# Altium project Compressor.PrjPcb (part 2 of 4)
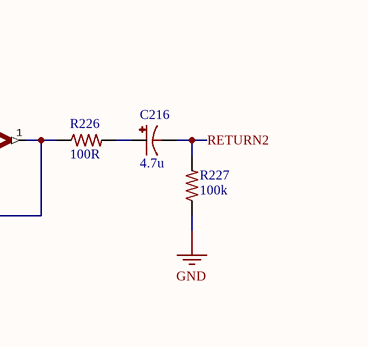
[diagram p4: Compressor.SchDoc, bottom right]

## Sheet Compressor.SchDoc (continued)
### Library data of the parts
ATTACK = POT_500kB_ALPHA_9mm: 500k Lin potentiometer round shaft; Price: 1.3; Dimensions: 9mm; Package: PCB Mounted
BLEND = POT_10kB_ALPHA_9mm: 10k Lin potentiometer round shaft; Price: 1.3; Dimensions: 9mm; Package: PCB Mounted
C1 C4 C101 C201 = MCVVT025M101EA6L: CAP ALUM 100UF 25V SMD; Manufacturer: Multicomp; Life (Hours): 2000Hour; Ripple Current (AC): 6.3mA; Supplier 1: Farnell; Supplier Part Number 1: 2611370; Manufacturer Part Number: MCVVT025M101EA6L; Stock: 1063; Pricing: 1=0.157, 50=0.104, 100=0.0932, 250=0.0801, 500=0.0681 (EUR); RoHS: No; Min Operating Temperature: -55°C; Max Operating Temperature: 105°C; Capacitance: 100uF; Voltage Rating: 25V; Packaging: Tape and Reel; Voltage Rating (DC): 25V; Diameter: 6.3mm; Height: 7.7mm; REACH SVHC: No SVHC; ComponentLink1URL: http://www.farnell.com/datasheets/2151198.pdf?src-supplier=Element14; ComponentLink1Description: http://www.farnell.com/datasheets/2151198.pdf?src-supplier=Element14; Price: 0.102
C2 C3 C5 C104 C105 C203 C204 = MC0603B104K500CT: CAP CER 100NF 50V X7R 0603; Manufacturer: Multicomp; Tolerance: 10%; Supplier 1: Farnell; Supplier Part Number 1: 1759122; Manufacturer Part Number: MC0603B104K500CT; Stock 1: 1057763; RoHS: Yes; Case/Package: 0603; Number of Pins: 2; Case Code (Metric): 1608; Case Code (Imperial): 0603; Min Operating Temperature: -55°C; Max Operating Temperature: 125°C; Packaging: Cut Tape; Voltage Rating: 50V; Capacitance: 100nF; Dielectric: X7R; Voltage Rating (DC): 50V; REACH SVHC: Unknown; ComponentLink1URL: https://datasheet.ciiva.com/22686/1901289-22686278.pdf?src-supplier=Element14; ComponentLink1Description: https://datasheet.ciiva.com/22686/1901289-22686278.pdf?src-supplier=Element14; ComponentLink2URL: https://datasheet.ciiva.com/22686/1901289-22686279.pdf?src-supplier=Element14; ComponentLink2Description: https://datasheet.ciiva.com/22686/1901289-22686279.pdf?src-supplier=Element14; ComponentLink3URL: https://datasheet.ciiva.com/22648/1901289-22648411.pdf?src-supplier=Element14; ComponentLink3Description: https://datasheet.ciiva.com/22648/1901289-22648411.pdf?src-supplier=Element14; Price: 0.0458
C102 C103 = MCVVT025M100CA1L: CAP ALUM 10UF 25V SMD; Manufacturer: Multicomp; Life (Hours): 2000Hour; Ripple Current (AC): 4mA; Supplier 1: Farnell; Supplier Part Number 1: 2611368; Manufacturer Part Number: MCVVT025M100CA1L; Stock: 2773; Pricing: 5=0.0897, 50=0.0592, 250=0.0457, 500=0.0388, 1000=0.0338 (EUR); RoHS: No; Min Operating Temperature: -55°C; Max Operating Temperature: 105°C; Capacitance: 10uF; Voltage Rating: 25V; Packaging: Cut Tape; Voltage Rating (DC): 25V; Diameter: 4mm; Height: 5.4mm; REACH SVHC: No SVHC; ComponentLink1URL: http://www.farnell.com/datasheets/2151198.pdf?src-supplier=Element14; ComponentLink1Description: http://www.farnell.com/datasheets/2151198.pdf?src-supplier=Element14; Price: 0.0592
C106 C108 C111 C113 = GRM1885C1H103JA01D: CAP CER 10NF 50V C0G/NP0 0603; Manufacturer: Murata; Material: Ceramic; Tolerance: 5%; Dielectric: C0G; Supplier 1: Farnell; Supplier Part Number 1: 2456107; Manufacturer Part Number: GRM1885C1H103JA01D; Stock 1: 99456; Pricing 1: 10 = 0.16600, 100 = 0.07230, 500 = 0.04810, 1000 = 0.04130, 2000 = 0.03640 (EUR); RoHS: Yes; Mount: Surface Mount; Case/Package: 0603; Case Code (Metric): 1608; Case Code (Imperial): 0603; Min Operating Temperature: -55°C; Max Operating Temperature: 125°C; Packaging: Tape and Reel; Package Quantity: 4000; Capacitance: 10nF; Voltage Rating: 50V; Voltage Rating (DC): 50V; Termination: SMD/SMT; Voltage: 50V; Length: 1.6mm; Height: 0.8mm; Width: 0.8mm; Thickness: 0.035inch; Lead Pitch: 0.5mm; Depth: 0.8mm; REACH SVHC: No SVHC; Lead Free: Lead Free; ComponentLink1URL: https://datasheet.ciiva.com/29537/partnumbering-e-01-29537910.pdf?src-supplier=Digi-Key; ComponentLink1Description: https://datasheet.ciiva.com/29537/partnumbering-e-01-29537910.pdf?src-supplier=Digi-Key; ComponentLink2URL: https://datasheet.ciiva.com/41860/partnumbering-e-01-41860759.pdf?src-supplier=Digi-Key; ComponentLink2Description: https://datasheet.ciiva.com/41860/partnumbering-e-01-41860759.pdf?src-supplier=Digi-Key; Price: 0.0723
C107 C115 C206 C208 C210 C211 C213 C214 = EEEFC1H1R0R: CAP ALUM 1UF 50V LESR SMD; Manufacturer: Panasonic; Dielectric Material: Aluminium; Tolerance: 20%; Ripple Current: 30mA; ESR (Equivalent Series Resistance): 5R; Life (Hours): 1000Hour; Leakage Current: 3uA; Lead Length: 1.8mm; Supplier 1: Farnell; Supplier Part Number 1: 9694528; Manufacturer Part Number: EEEFC1H1R0R; Stock 1: 3801; Pricing 1: 5 = 0.29200, 50 = 0.15100, 250 = 0.12600, 500 = 0.09460, 1000 = 0.07990 (EUR); RoHS: Yes; Mount: Surface Mount; Case/Package: Radial; Number of Pins: 2; Material: Aluminium; Contact Plating: Tin; Min Operating Temperature: -40°C; Max Operating Temperature: 105°C; Capacitance: 1uF; Voltage Rating: 50V; Packaging: Tape and Reel; Voltage Rating (DC): 50V; Package Quantity: 2000; Termination: SMD/SMT; Ripple Current (AC): 30mA; Impedance: 5R; Voltage: 50V; Diameter: 4mm; Length: 5.5mm; Height: 5.4mm; Height - Seated (Max): 0.213inch; Width: 4.3mm; Lead Pitch: 1mm; Radiation Hardening: No; REACH SVHC: No SVHC; Lead Free: Lead Free; ComponentLink1URL: https://datasheet.ciiva.com/11779/0900766b806bc525-11779769.pdf?src-supplier=RSComponents; ComponentLink1Description: https://datasheet.ciiva.com/11779/0900766b806bc525-11779769.pdf?src-supplier=RSComponents; ComponentLink2URL: https://datasheet.ciiva.com/29313/443524-da-01-en-smd-elko-vfc-b-1-0-uf-50v-29313787.pdf?src-supplier=Conrad; ComponentLink2Description: https://datasheet.ciiva.com/29313/443524-da-01-en-smd-elko-vfc-b-1-0-uf-50v-29313787.pdf?src-supplier=Conrad; ComponentLink3URL: https://datasheet.ciiva.com/10331/aba0000ce5-10331045.pdf?src-supplier=Avnet; ComponentLink3Description: https://datasheet.ciiva.com/10331/aba0000ce5-10331045.pdf?src-supplier=Avnet; ComponentLink4URL: https://datasheet.ciiva.com/43485/31718-43485413.pdf?src-supplier=Farnell; ComponentLink4Description: https://datasheet.ciiva.com/43485/31718-43485413.pdf?src-supplier=Farnell; ComponentLink5URL: https://datasheet.ciiva.com/17353/aba0000ce5-17353382.pdf?src-supplier=Avnet+Europe; ComponentLink5Description: https://datasheet.ciiva.com/17353/aba0000ce5-17353382.pdf?src-supplier=Avnet+Europe; ComponentLink6URL: https://datasheet.ciiva.com/24024/aba0000ce5-68492-24024840.pdf?src-supplier=Mouser; ComponentLink6Description: https://datasheet.ciiva.com/24024/aba0000ce5-68492-24024840.pdf?src-supplier=Mouser; ComponentLink7URL: https://datasheet.ciiva.com/48542/eeefc-series-eng-tds-48542747.pdf?src-supplier=Distrelec; ComponentLink7Description: https://datasheet.ciiva.com/48542/eeefc-series-eng-tds-48542747.pdf?src-supplier=Distrelec; ComponentLink8URL: https://datasheet.ciiva.com/30181/aba0000ce5-30181516.pdf?src-supplier=Onlinecomponents.com; ComponentLink8Description: https://datasheet.ciiva.com/30181/aba0000ce5-30181516.pdf?src-supplier=Onlinecomponents.com; ComponentLink9URL: https://datasheet.ciiva.com/14596/70068018-14596941.pdf?src-supplier=Allied+Electronics; ComponentLink9Description: https://datasheet.ciiva.com/14596/70068018-14596941.pdf?src-supplier=Allied+Electronics; ComponentLink10URL: https://datasheet.ciiva.com/46388/31718-46388238.pdf?src-supplier=Element14; ComponentLink10Description: https://datasheet.ciiva.com/46388/31718-46388238.pdf?src-supplier=Element14; ComponentLink11URL: https://datasheet.ciiva.com/14606/70256381-14606527.pdf?src-supplier=Allied+Electronics; ComponentLink11Description: https://datasheet.ciiva.com/14606/70256381-14606527.pdf?src-supplier=Allied+Electronics; Price: 0.151
C109 = T491A105K016AT: CAP TANT 1UF 16V; Manufacturer: KEMET; Dielectric Material: Tantalum; Tolerance: 20%; ESR (Equivalent Series Resistance): 10R; Life (Hours): 2000Hour; Polarity: Polar; Dissipation Factor: 4%; Leakage Current: 500nA; Ripple Current: 87mA; Supplier 1: Farnell; Supplier Part Number 1: 1457406; Manufacturer Part Number: T491A105K016AT; RoHS: Yes; Category: Tantalum Capacitors; Stock: 40067; Pricing: 5=0.25600, 50=0.14500, 250=0.11900, 500=0.10600, 1000=0.09590 (EUR); Mount: Surface Mount,PCB; Case/Package: 1206; Number of Pins: 2; Case Code (Imperial): 1206; Case Code (Metric): 3216; Min Operating Temperature: -55°C; Max Operating Temperature: 125°C; Capacitance: 1uF; Packaging: Tape and Reel; Voltage Rating: 16V; Features: General Purpose; Package Quantity: 1; Voltage Rating (DC): 16V; Termination: SMD/SMT; Voltage: 16V; Length: 3.2mm; Height: 1.6mm; Depth: 1.6mm; Width: 1.6mm; Height - Seated (Max): 0.071inch; REACH SVHC: No SVHC; Lead Free: Lead Free; ComponentLink1URL: https://datasheet.ciiva.com/7696/1732736-7696289.pdf?src-supplier=Element14; ComponentLink1Description: https://datasheet.ciiva.com/7696/1732736-7696289.pdf?src-supplier=Element14; ComponentLink2URL: https://datasheet.ciiva.com/20171/458280-da-en-01-20171909.pdf?src-supplier=Rapid+Electronics; ComponentLink2Description: https://datasheet.ciiva.com/20171/458280-da-en-01-20171909.pdf?src-supplier=Rapid+Electronics; ComponentLink3URL: https://datasheet.ciiva.com/34302/1573169-34302502.pdf?src-supplier=Jameco; ComponentLink3Description: https://datasheet.ciiva.com/34302/1573169-34302502.pdf?src-supplier=Jameco; ComponentLink4URL: https://datasheet.ciiva.com/11793/0900766b80718482-11793119.pdf?src-supplier=RSComponents; ComponentLink4Description: https://datasheet.ciiva.com/11793/0900766b80718482-11793119.pdf?src-supplier=RSComponents; ComponentLink5URL: https://datasheet.ciiva.com/5934/kem-t2005-t491-5934792.pdf?src-supplier=Farnell; ComponentLink5Description: https://datasheet.ciiva.com/5934/kem-t2005-t491-5934792.pdf?src-supplier=Farnell; ComponentLink6URL: https://datasheet.ciiva.com/12882/kem-t2005-t491-12882490.pdf?src-supplier=Mouser; ComponentLink6Description: https://datasheet.ciiva.com/12882/kem-t2005-t491-12882490.pdf?src-supplier=Mouser; ComponentLink7URL: https://datasheet.ciiva.com/32431/t491a105k016zt-eng-tds-32431595.pdf?src-supplier=Distrelec; ComponentLink7Description: https://datasheet.ciiva.com/32431/t491a105k016zt-eng-tds-32431595.pdf?src-supplier=Distrelec; ComponentLink8URL: https://datasheet.ciiva.com/257/kem-t2005-t491-257404.pdf?src-supplier=Digi-Key; ComponentLink8Description: https://datasheet.ciiva.com/257/kem-t2005-t491-257404.pdf?src-supplier=Digi-Key; ComponentLink9URL: https://datasheet.ciiva.com/257/kem-t2005-t491-257405.pdf?src-supplier=Digi-Key; ComponentLink9Description: https://datasheet.ciiva.com/257/kem-t2005-t491-257405.pdf?src-supplier=Digi-Key; ComponentLink10URL: https://datasheet.ciiva.com/7696/kem-t2005-t491-7696429.pdf?src-supplier=Element14; ComponentLink10Description: https://datasheet.ciiva.com/7696/kem-t2005-t491-7696429.pdf?src-supplier=Element14; ComponentLink11URL: https://datasheet.ciiva.com/257/kem-t2005-t491-257406.pdf?src-supplier=Digi-Key; ComponentLink11Description: https://datasheet.ciiva.com/257/kem-t2005-t491-257406.pdf?src-supplier=Digi-Key; ComponentLink12URL: https://datasheet.ciiva.com/14595/70095774-14595055.pdf?src-supplier=Allied+Electronics; ComponentLink12Description: https://datasheet.ciiva.com/14595/70095774-14595055.pdf?src-supplier=Allied+Electronics
C110 = GRM1885C1H102JA01D: CAP CER 1NF 50V C0G/NP0 0603; Manufacturer: Murata; Material: Ceramic; Tolerance: 5%; Dielectric: C0G; Temperature Coefficient: 30ppm/°C; Insulation Resistance: 10GR; Supplier 1: Farnell; Supplier Part Number 1: 8819920; Manufacturer Part Number: GRM1885C1H102JA01D; Stock 1: 138332; Pricing 1: 10 = 0.08650, 100 = 0.03970, 500 = 0.02290, 1000 = 0.01860, 2000 = 0.01690 (EUR); RoHS: Yes; Mount: Surface Mount; Case/Package: 0603; Number of Pins: 2; Case Code (Imperial): 0603; Case Code (Metric): 1608; Dielectric Material: Ceramic; Min Operating Temperature: -55°C; Max Operating Temperature: 125°C; Capacitance: 1nF; Voltage Rating: 50V; Packaging: Tape and Reel; Voltage Rating (DC): 50V; Package Quantity: 1; Termination: SMD/SMT; Voltage: 50V; Length: 1.6mm; Height: 0.8mm; Width: 0.8mm; Thickness: 0.035inch; Depth: 0.8mm; Radiation Hardening: No; REACH SVHC: No SVHC; Lead Free: Lead Free; ComponentLink1URL: https://datasheet.ciiva.com/18184/getdatasheetpartid-153109-18184812.pdf?src-supplier=Verical; ComponentLink1Description: https://datasheet.ciiva.com/18184/getdatasheetpartid-153109-18184812.pdf?src-supplier=Verical; ComponentLink2URL: https://datasheet.ciiva.com/29149/450301-da-01-en-vs-kondensator-0603-29149020.pdf?src-supplier=Conrad; ComponentLink2Description: https://datasheet.ciiva.com/29149/450301-da-01-en-vs-kondensator-0603-29149020.pdf?src-supplier=Conrad; ComponentLink3URL: https://datasheet.ciiva.com/5421/product-5421450.pdf?src-supplier=Mouser; ComponentLink3Description: https://datasheet.ciiva.com/5421/product-5421450.pdf?src-supplier=Mouser; ComponentLink4URL: https://datasheet.ciiva.com/131/partnumbering-e-01-131963.pdf?src-supplier=Digi-Key; ComponentLink4Description: https://datasheet.ciiva.com/131/partnumbering-e-01-131963.pdf?src-supplier=Digi-Key; ComponentLink5URL: https://datasheet.ciiva.com/131/partnumbering-e-01-131964.pdf?src-supplier=Digi-Key; ComponentLink5Description: https://datasheet.ciiva.com/131/partnumbering-e-01-131964.pdf?src-supplier=Digi-Key; ComponentLink6URL: https://datasheet.ciiva.com/6072/4360-6072460.pdf?src-supplier=Farnell; ComponentLink6Description: https://datasheet.ciiva.com/6072/4360-6072460.pdf?src-supplier=Farnell; ComponentLink7URL: https://datasheet.ciiva.com/131/partnumbering-e-01-131965.pdf?src-supplier=Digi-Key; ComponentLink7Description: https://datasheet.ciiva.com/131/partnumbering-e-01-131965.pdf?src-supplier=Digi-Key; ComponentLink8URL: https://datasheet.ciiva.com/7828/1784402-7828893.pdf?src-supplier=Element14; ComponentLink8Description: https://datasheet.ciiva.com/7828/1784402-7828893.pdf?src-supplier=Element14; ComponentLink9URL: https://datasheet.ciiva.com/7828/1784402-7828894.pdf?src-supplier=Element14; ComponentLink9Description: https://datasheet.ciiva.com/7828/1784402-7828894.pdf?src-supplier=Element14; ComponentLink10URL: https://datasheet.ciiva.com/7828/4360-7828895.pdf?src-supplier=Element14; ComponentLink10Description: https://datasheet.ciiva.com/7828/4360-7828895.pdf?src-supplier=Element14; Price: 0.0397
C112 C209 C212 = T491A106K016AT: CAP TANT 10UF 16V; Manufacturer: KEMET; Dielectric Material: Tantalum; Tolerance: 10%; ESR (Equivalent Series Resistance): 7R; Life (Hours): 2000Hour; Polarity: Polar; Leakage Current: 1.6uA; Ripple Current: 104mA; Supplier 1: Farnell; Supplier Part Number 1: 1457414; Manufacturer Part Number: T491A106K016AT; RoHS: Yes; Category: Tantalum Capacitors; Stock: 36020; Pricing: 5=0.30300, 50=0.16000, 250=0.13300, 500=0.12000, 1000=0.10200 (EUR); Mount: Surface Mount,PCB; Case/Package: 1206; Number of Pins: 2; Case Code (Metric): 3216; Case Code (Imperial): 1206; Min Operating Temperature: -55°C; Max Operating Temperature: 125°C; Capacitance: 10uF; Packaging: Tape and Reel; Voltage Rating: 16V; Features: General Purpose; Dissipation Factor: 10%; Package Quantity: 1; Voltage Rating (DC): 16V; Termination: SMD/SMT; Failure Rate: 0.001%; Voltage: 16V; Length: 3.2mm; Height: 1.6mm; Width: 1.6mm; Depth: 1.6mm; Height - Seated (Max): 0.071inch; Lead Pitch: 1.2mm; Radiation Hardening: No; Lead Free: Lead Free; REACH SVHC: No SVHC; ComponentLink1URL: https://datasheet.ciiva.com/7696/1732745-7696294.pdf?src-supplier=Element14; ComponentLink1Description: https://datasheet.ciiva.com/7696/1732745-7696294.pdf?src-supplier=Element14; ComponentLink2URL: https://datasheet.ciiva.com/34302/1573257-34302505.pdf?src-supplier=Jameco; ComponentLink2Description: https://datasheet.ciiva.com/34302/1573257-34302505.pdf?src-supplier=Jameco; ComponentLink3URL: https://datasheet.ciiva.com/7696/1854511-7696293.pdf?src-supplier=Element14; ComponentLink3Description: https://datasheet.ciiva.com/7696/1854511-7696293.pdf?src-supplier=Element14; ComponentLink4URL: https://datasheet.ciiva.com/14586/70095774-14586694.pdf?src-supplier=Allied+Electronics; ComponentLink4Description: https://datasheet.ciiva.com/14586/70095774-14586694.pdf?src-supplier=Allied+Electronics; ComponentLink5URL: https://datasheet.ciiva.com/6248/kem-t2005-t491-6248087.pdf?src-supplier=Digi-Key; ComponentLink5Description: https://datasheet.ciiva.com/6248/kem-t2005-t491-6248087.pdf?src-supplier=Digi-Key; ComponentLink6URL: https://datasheet.ciiva.com/6248/kem-t2005-t491-6248088.pdf?src-supplier=Digi-Key; ComponentLink6Description: https://datasheet.ciiva.com/6248/kem-t2005-t491-6248088.pdf?src-supplier=Digi-Key; ComponentLink7URL: https://datasheet.ciiva.com/14113/t491serie-eng-tds-14113132.pdf?src-supplier=Distrelec; ComponentLink7Description: https://datasheet.ciiva.com/14113/t491serie-eng-tds-14113132.pdf?src-supplier=Distrelec; ComponentLink8URL: https://datasheet.ciiva.com/7696/1923792-7696431.pdf?src-supplier=Element14; ComponentLink8Description: https://datasheet.ciiva.com/7696/1923792-7696431.pdf?src-supplier=Element14; ComponentLink9URL: https://datasheet.ciiva.com/7696/1854511-7696295.pdf?src-supplier=Element14; ComponentLink9Description: https://datasheet.ciiva.com/7696/1854511-7696295.pdf?src-supplier=Element14; ComponentLink10URL: https://datasheet.ciiva.com/14605/70095774-14605543.pdf?src-supplier=Allied+Electronics; ComponentLink10Description: https://datasheet.ciiva.com/14605/70095774-14605543.pdf?src-supplier=Allied+Electronics; ComponentLink11URL: https://datasheet.ciiva.com/7696/1446014-7696296.pdf?src-supplier=Element14; ComponentLink11Description: https://datasheet.ciiva.com/7696/1446014-7696296.pdf?src-supplier=Element14; ComponentLink12URL: https://datasheet.ciiva.com/6248/kem-t2005-t491-6248089.pdf?src-supplier=Digi-Key; ComponentLink12Description: https://datasheet.ciiva.com/6248/kem-t2005-t491-6248089.pdf?src-supplier=Digi-Key; ComponentLink13URL: https://datasheet.ciiva.com/12882/kem-t2005-t491-12882730.pdf?src-supplier=Mouser; ComponentLink13Description: https://datasheet.ciiva.com/12882/kem-t2005-t491-12882730.pdf?src-supplier=Mouser; ComponentLink14URL: https://datasheet.ciiva.com/39123/kem-t2005-t491-39123278.pdf?src-supplier=Onlinecomponents.com; ComponentLink14Description: https://datasheet.ciiva.com/39123/kem-t2005-t491-39123278.pdf?src-supplier=Onlinecomponents.com; ComponentLink15URL: https://datasheet.ciiva.com/29244/458306-da-01-de-kondensator-10uf-3216-10pr-16v-85c-29244588.pdf?src-supplier=Conrad; ComponentLink15Description: https://datasheet.ciiva.com/29244/458306-da-01-de-kondensator-10uf-3216-10pr-16v-85c-29244588.pdf?src-supplier=Conrad
C114 = GCM31M5C1H473JA16L: CAP CER 47NF 50V C0G/NP0 1206; Manufacturer: Murata; Tolerance: 5%; Dielectric: C0G; Supplier 1: Farnell; Supplier Part Number 1: 2218706; Manufacturer Part Number: GCM31M5C1H473JA16L; Stock 1: 4840; Pricing 1: 5 = 0.24800, 50 = 0.13700, 250 = 0.11600, 500 = 0.08300, 1500 = 0.07700, 3000 = 0.07360 (EUR); RoHS: Yes; Mount: Surface Mount; Case/Package: 1206; Case Code (Metric): 3216; Case Code (Imperial): 1206; Min Operating Temperature: -55°C; Max Operating Temperature: 125°C; Package Quantity: 1; Capacitance: 47nF; Voltage Rating: 50V; Packaging: Tape and Reel; Voltage Rating (DC): 50V; Termination: SMD/SMT; Length: 3.2mm; Height: 1.15mm; Width: 0.063inch; Thickness: 0.049inch; Depth: 1.6mm; Ratings: AEC-Q200; Radiation Hardening: No; REACH SVHC: No SVHC; ComponentLink1URL: https://datasheet.ciiva.com/136/s0720e-136368.pdf?src-supplier=Digi-Key; ComponentLink1Description: https://datasheet.ciiva.com/136/s0720e-136368.pdf?src-supplier=Digi-Key; ComponentLink2URL: https://datasheet.ciiva.com/11607/product-11607763.pdf?src-supplier=Avnet; ComponentLink2Description: https://datasheet.ciiva.com/11607/product-11607763.pdf?src-supplier=Avnet; ComponentLink3URL: https://datasheet.ciiva.com/18183/getdatasheetpartid-569724-18183753.pdf?src-supplier=Verical; ComponentLink3Description: https://datasheet.ciiva.com/18183/getdatasheetpartid-569724-18183753.pdf?src-supplier=Verical; ComponentLink4URL: https://datasheet.ciiva.com/140/s0717e-140734.pdf?src-supplier=Digi-Key; ComponentLink4Description: https://datasheet.ciiva.com/140/s0717e-140734.pdf?src-supplier=Digi-Key; ComponentLink5URL: https://datasheet.ciiva.com/140/s0717e-140735.pdf?src-supplier=Digi-Key; ComponentLink5Description: https://datasheet.ciiva.com/140/s0717e-140735.pdf?src-supplier=Digi-Key; Price: 0.333
C116 = MC0603N390J500CT: CAP CER 39PF 50V C0G/NP0 0603; Manufacturer: Multicomp; Temperature Coefficient: 30ppm/°C; Dielectric: C0G; Tolerance: 5%; Supplier 1: Farnell; Supplier Part Number 1: 1759060; Manufacturer Part Number: MC0603N390J500CT; RoHS: Yes; Category: Ceramic Capacitors; Stock: 6461; Pricing: 10=0.03890, 100=0.02920, 500=0.01670, 1000=0.01170, 2000=0.01080 (EUR); Case/Package: 0603; Number of Pins: 2; Case Code (Imperial): 0603; Case Code (Metric): 1608; Min Operating Temperature: -55°C; Max Operating Temperature: 125°C; Capacitance: 39pF; Packaging: Cut Tape; Voltage Rating: 50V; Voltage Rating (DC): 50V; Width: 0.8mm; REACH SVHC: Unknown; ComponentLink1URL: https://datasheet.ciiva.com/22648/1901289-22648501.pdf?src-supplier=Element14; ComponentLink1Description: https://datasheet.ciiva.com/22648/1901289-22648501.pdf?src-supplier=Element14; ComponentLink2URL: https://datasheet.ciiva.com/22675/1901289-22675703.pdf?src-supplier=Element14; ComponentLink2Description: https://datasheet.ciiva.com/22675/1901289-22675703.pdf?src-supplier=Element14
C117 C216 = EEEFC1H4R7R: CAP ALUM 4.7UF 50V LESR SMD; Manufacturer: Panasonic; Dielectric Material: Aluminium; Tolerance: 20%; Ripple Current: 50mA; Impedance: 3R; Life (Hours): 1000Hour; Leakage Current: 3uA; Lead Length: 2.2mm; Supplier 1: Farnell; Supplier Part Number 1: 9694552; Manufacturer Part Number: EEEFC1H4R7R; Stock 1: 1971; Pricing 1: 1 = 0.26900, 50 = 0.18200, 100 = 0.14200, 250 = 0.13200, 500 = 0.09890 (EUR); RoHS: Yes; Mount: Surface Mount; Case/Package: Radial; Number of Pins: 2; Contact Plating: Tin; Min Operating Temperature: -40°C; Max Operating Temperature: 105°C; Capacitance: 4.7uF; Voltage Rating: 50V; Packaging: Tape and Reel; Package Quantity: 1; Ripple Current (AC): 50mA; Voltage Rating (DC): 50V; ESR (Equivalent Series Resistance): 3R; Termination: SMD/SMT; Voltage: 50V; Diameter: 5mm; Length: 5.5mm; Height: 5.4mm; Height - Seated (Max): 0.213inch; Lead Pitch: 1.5mm; Width: 5.3mm; Radiation Hardening: No; REACH SVHC: No SVHC; Lead Free: Lead Free; ComponentLink1URL: https://datasheet.ciiva.com/11778/0900766b806bc525-11778368.pdf?src-supplier=RSComponents; ComponentLink1Description: https://datasheet.ciiva.com/11778/0900766b806bc525-11778368.pdf?src-supplier=RSComponents; ComponentLink2URL: https://datasheet.ciiva.com/6196/31718-6196262.pdf?src-supplier=Farnell; ComponentLink2Description: https://datasheet.ciiva.com/6196/31718-6196262.pdf?src-supplier=Farnell; ComponentLink3URL: https://datasheet.ciiva.com/30150/aba0000ce5-30150534.pdf?src-supplier=Onlinecomponents.com; ComponentLink3Description: https://datasheet.ciiva.com/30150/aba0000ce5-30150534.pdf?src-supplier=Onlinecomponents.com; ComponentLink4URL: https://datasheet.ciiva.com/48542/eeefc-series-eng-tds-48542743.pdf?src-supplier=Distrelec; ComponentLink4Description: https://datasheet.ciiva.com/48542/eeefc-series-eng-tds-48542743.pdf?src-supplier=Distrelec; ComponentLink5URL: https://datasheet.ciiva.com/14595/70256381-14595032.pdf?src-supplier=Allied+Electronics; ComponentLink5Description: https://datasheet.ciiva.com/14595/70256381-14595032.pdf?src-supplier=Allied+Electronics; ComponentLink6URL: https://datasheet.ciiva.com/43485/31718-43485416.pdf?src-supplier=Farnell; ComponentLink6Description: https://datasheet.ciiva.com/43485/31718-43485416.pdf?src-supplier=Farnell; ComponentLink7URL: https://datasheet.ciiva.com/24072/aba0000ce5-68492-24072137.pdf?src-supplier=Mouser; ComponentLink7Description: https://datasheet.ciiva.com/24072/aba0000ce5-68492-24072137.pdf?src-supplier=Mouser; ComponentLink8URL: https://datasheet.ciiva.com/14602/70256381-14602202.pdf?src-supplier=Allied+Electronics; ComponentLink8Description: https://datasheet.ciiva.com/14602/70256381-14602202.pdf?src-supplier=Allied+Electronics; ComponentLink9URL: https://datasheet.ciiva.com/46376/31718-46376378.pdf?src-supplier=Element14; ComponentLink9Description: https://datasheet.ciiva.com/46376/31718-46376378.pdf?src-supplier=Element14; ComponentLink10URL: https://datasheet.ciiva.com/14596/70068018-14596798.pdf?src-supplier=Allied+Electronics; ComponentLink10Description: https://datasheet.ciiva.com/14596/70068018-14596798.pdf?src-supplier=Allied+Electronics; Price: 0.27
C202 = MCVVT025M470EA1L: CAP ALUM 47UF 25V SMD; Manufacturer: Multicomp; Life (Hours): 2000Hour; Ripple Current (AC): 6.3mA; Supplier 1: Farnell; Supplier Part Number 1: 2611377; Manufacturer Part Number: MCVVT025M470EA1L; Stock: 1436; Pricing: 1=0.125, 50=0.0825, 100=0.0741, 250=0.0637, 500=0.0542 (EUR); RoHS: No; Min Operating Temperature: -55°C; Max Operating Temperature: 105°C; Capacitance: 47uF; Voltage Rating: 25V; Packaging: Cut Tape; Voltage Rating (DC): 25V; Diameter: 6.3mm; Height: 5.4mm; REACH SVHC: No SVHC; ComponentLink1URL: http://www.farnell.com/datasheets/2151198.pdf?src-supplier=Farnell; ComponentLink1Description: http://www.farnell.com/datasheets/2151198.pdf?src-supplier=Farnell; ComponentLink2URL: http://www.farnell.com/datasheets/2151198.pdf?src-supplier=Element14; ComponentLink2Description: http://www.farnell.com/datasheets/2151198.pdf?src-supplier=Element14; Price: 0.0825
C205 C215 = GRM31C5C1H104JA01L: CAP CER 100NF 50V C0G/NP0 1206; Manufacturer: Murata; Material: Ceramic; Tolerance: 5%; Dielectric: C0G; Temperature Coefficient: 30ppm/°C; Supplier 1: Farnell; Supplier Part Number 1: 2494294; Manufacturer Part Number: GRM31C5C1H104JA01L; Stock 1: 206865; Pricing 1: 5 = 0.62500, 50 = 0.31000, 250 = 0.29700, 500 = 0.22200, 1000 = 0.18900 (EUR); RoHS: Yes; Mount: Surface Mount; Case/Package: 1206; Weight: 0.000571oz; Case Code (Metric): 3216; Case Code (Imperial): 1206; Min Operating Temperature: -55°C; Max Operating Temperature: 125°C; Capacitance: 100nF; Packaging: Tape and Reel; Package Quantity: 1; Voltage Rating: 50V; Voltage Rating (DC): 50V; Termination: SMD/SMT; Voltage: 50V; Length: 3.2mm; Height: 1.6mm; Width: 0.063inch; Thickness: 0.071inch; Depth: 1.6mm; Radiation Hardening: No; REACH SVHC: No SVHC; Lead Free: Lead Free; ComponentLink1URL: https://datasheet.ciiva.com/11618/product-11618880.pdf?src-supplier=Avnet; ComponentLink1Description: https://datasheet.ciiva.com/11618/product-11618880.pdf?src-supplier=Avnet; ComponentLink2URL: https://datasheet.ciiva.com/29200/453430-da-01-en-vs-kondensator-1206-29200201.pdf?src-supplier=Conrad; ComponentLink2Description: https://datasheet.ciiva.com/29200/453430-da-01-en-vs-kondensator-1206-29200201.pdf?src-supplier=Conrad; ComponentLink3URL: https://datasheet.ciiva.com/5420/product-5420070.pdf?src-supplier=Mouser; ComponentLink3Description: https://datasheet.ciiva.com/5420/product-5420070.pdf?src-supplier=Mouser; ComponentLink4URL: https://datasheet.ciiva.com/16461/product-16461275.pdf?src-supplier=Future+Electronics; ComponentLink4Description: https://datasheet.ciiva.com/16461/product-16461275.pdf?src-supplier=Future+Electronics; ComponentLink5URL: https://datasheet.ciiva.com/6270/partnumbering-e-01-6270255.pdf?src-supplier=Digi-Key; ComponentLink5Description: https://datasheet.ciiva.com/6270/partnumbering-e-01-6270255.pdf?src-supplier=Digi-Key; Price: 0.31
C207 = MC0603N470J500CT: CAP CER 47PF 50V C0G/NP0 0603; Manufacturer: Multicomp; Tolerance: 5%; Dielectric: C0G; Temperature Coefficient: 30ppm/°C; Supplier 1: Farnell; Supplier Part Number 1: 1759062; Manufacturer Part Number: MC0603N470J500CT; Stock: 148629; Pricing: 10=0.0246, 100=0.0199, 500=0.0123, 1000=0.0097, 2000=0.0089 (EUR); RoHS: Yes; Case/Package: 0603; Number of Pins: 2; Case Code (Metric): 1608; Case Code (Imperial): 0603; Min Operating Temperature: -55°C; Max Operating Temperature: 125°C; Packaging: Tape and Reel; Voltage Rating: 50V; Capacitance: 47pF; Voltage Rating (DC): 50V; Width: 0.8mm; REACH SVHC: Unknown; ComponentLink1URL: https://datasheet.ciiva.com/22648/1901289-22648503.pdf?src-supplier=Element14; ComponentLink1Description: https://datasheet.ciiva.com/22648/1901289-22648503.pdf?src-supplier=Element14; ComponentLink2URL: https://datasheet.ciiva.com/22682/1901289-22682812.pdf?src-supplier=Element14; ComponentLink2Description: https://datasheet.ciiva.com/22682/1901289-22682812.pdf?src-supplier=Element14; ComponentLink3URL: https://datasheet.ciiva.com/22682/1901289-22682813.pdf?src-supplier=Element14; ComponentLink3Description: https://datasheet.ciiva.com/22682/1901289-22682813.pdf?src-supplier=Element14; Price: 0.02
COMP SUSTAIN = POT_500kC_ALPHA_9mm: 500k Anti Log potentiometer round shaft; Price: 1.3; Dimensions: 9mm; Package: PCB Mounted
D1 = S1A: DIODE GEN PURP 50V 1A SMA; Manufacturer: ON Semiconductor / Fairchild; Peak Reverse Current: 1uA; Max Surge Current: 40A; Forward Voltage: 1.1V; Peak Non-Repetitive Surge Current: 30A; Element Configuration: Single; Capacitance: 12pF; Recovery Time: 1800ns; Reverse Recovery Time: 1.8us; Polarity: Standard; Power Dissipation: 1.4W; Supplier 1: Farnell; Supplier Part Number 1: 9843868; Manufacturer Part Number: S1A; Stock: 34555; Pricing: 5=0.184, 25=0.179, 100=0.0727, 250=0.0669, 500=0.0667, 1000=0.0364, 5000=0.0293 (EUR); RoHS: Yes; Mount: Surface Mount; Case/Package: SMA; Number of Pins: 2; Weight: 0.106g; Contact Plating: Tin; Min Operating Temperature: -55°C; Max Operating Temperature: 150°C; Packaging: Tape and Reel; Package Quantity: 1; Voltage Rating (DC): 50V; Current Rating: 1A; Output Current: 1A; Forward Current: 1A; Max Repetitive Reverse Voltage (Vrrm): 50V; Average Rectified Current: 1A; Max Forward Surge Current (Ifsm): 30A; Max Reverse Voltage (DC): 50V; Reverse Voltage: 50V; Width: 5.28mm; Radiation Hardening: No; REACH SVHC: No SVHC; Lead Free: Lead Free; ComponentLink1URL: https://datasheet.ciiva.com/910/s1a-910480.pdf?src-supplier=Avnet; ComponentLink1Description: https://datasheet.ciiva.com/910/s1a-910480.pdf?src-supplier=Avnet; ComponentLink2URL: https://datasheet.ciiva.com/23683/1730038-23683616.pdf?src-supplier=Newark; ComponentLink2Description: https://datasheet.ciiva.com/23683/1730038-23683616.pdf?src-supplier=Newark; ComponentLink3URL: https://datasheet.ciiva.com/4452/s1a-191336-4452662.pdf?src-supplier=Mouser; ComponentLink3Description: https://datasheet.ciiva.com/4452/s1a-191336-4452662.pdf?src-supplier=Mouser; ComponentLink4URL: https://datasheet.ciiva.com/25624/0900766b80f9b629-25624903.pdf?src-supplier=RSComponents; ComponentLink4Description: https://datasheet.ciiva.com/25624/0900766b80f9b629-25624903.pdf?src-supplier=RSComponents; ComponentLink5URL: https://datasheet.ciiva.com/916/s1a-916898.pdf?src-supplier=Digi-Key; ComponentLink5Description: https://datasheet.ciiva.com/916/s1a-916898.pdf?src-supplier=Digi-Key; ComponentLink6URL: https://datasheet.ciiva.com/916/s1a-916899.pdf?src-supplier=Digi-Key; ComponentLink6Description: https://datasheet.ciiva.com/916/s1a-916899.pdf?src-supplier=Digi-Key; ComponentLink7URL: https://datasheet.ciiva.com/916/s1a-916900.pdf?src-supplier=Digi-Key; ComponentLink7Description: https://datasheet.ciiva.com/916/s1a-916900.pdf?src-supplier=Digi-Key; ComponentLink8URL: https://datasheet.ciiva.com/16800/s1a-16800103.pdf?src-supplier=Future+Electronics; ComponentLink8Description: https://datasheet.ciiva.com/16800/s1a-16800103.pdf?src-supplier=Future+Electronics; ComponentLink9URL: https://datasheet.ciiva.com/28469/1766308-28469031.pdf?src-supplier=Element14; ComponentLink9Description: https://datasheet.ciiva.com/28469/1766308-28469031.pdf?src-supplier=Element14; ComponentLink10URL: https://datasheet.ciiva.com/26231/s1k-26231832.pdf?src-supplier=Avnet+Europe; ComponentLink10Description: https://datasheet.ciiva.com/26231/s1k-26231832.pdf?src-supplier=Avnet+Europe; ComponentLink11URL: https://datasheet.ciiva.com/16474/s1k-16474283.pdf?src-supplier=Avnet+Asia; ComponentLink11Description: https://datasheet.ciiva.com/16474/s1k-16474283.pdf?src-supplier=Avnet+Asia; Price: 0.072
D2 D3 D101 D102 D201 = 1N4148WS: DIODE GEN PURP 75V 150MA SOD323F; Manufacturer: ON Semiconductor / Fairchild; Element Configuration: Single; Reverse Recovery Time: 4ns; Forward Voltage: 1V; Peak Reverse Current: 5uA; Power Dissipation: 200mW; Max Forward Surge Current (Ifsm): 2A; Supplier 1: Farnell; Supplier Part Number 1: 2453269; Manufacturer Part Number: 1N4148WS; Stock: 379338; Pricing: 5=0.155, 25=0.151, 100=0.0529, 250=0.0498, 500=0.0477, 1000=0.0243, 5000=0.0193 (EUR); RoHS: Yes; Mount: Surface Mount; Number of Pins: 2; Weight: 0.0276g; Contact Plating: Tin; Min Operating Temperature: -55°C; Max Operating Temperature: 150°C; Forward Current: 150mA; Max Repetitive Reverse Voltage (Vrrm): 75V; Packaging: Tape and Reel; Package Quantity: 1; Average Rectified Current: 150mA; Max Reverse Voltage (DC): 75V; Recovery Time: 4ns; Reverse Voltage: 75V; Length: 1.8mm; Height: 1mm; Width: 1.35mm; Radiation Hardening: No; Lead Free: Lead Free; REACH SVHC: No SVHC; ComponentLink1URL: https://datasheet.ciiva.com/25968/1n914bws-25968945.pdf?src-supplier=Avnet+Europe; ComponentLink1Description: https://datasheet.ciiva.com/25968/1n914bws-25968945.pdf?src-supplier=Avnet+Europe; ComponentLink2URL: https://datasheet.ciiva.com/30479/0900766b810e1cd3-30479206.pdf?src-supplier=RSComponents; ComponentLink2Description: https://datasheet.ciiva.com/30479/0900766b810e1cd3-30479206.pdf?src-supplier=RSComponents; ComponentLink3URL: https://datasheet.ciiva.com/15208/getdatasheetpartid-127819-15208358.pdf?src-supplier=Verical; ComponentLink3Description: https://datasheet.ciiva.com/15208/getdatasheetpartid-127819-15208358.pdf?src-supplier=Verical; ComponentLink4URL: https://datasheet.ciiva.com/8300/1n914bws-8300360.pdf?src-supplier=Avnet; ComponentLink4Description: https://datasheet.ciiva.com/8300/1n914bws-8300360.pdf?src-supplier=Avnet; ComponentLink5URL: https://datasheet.ciiva.com/910/1n4148ws-910380.pdf?src-supplier=Digi-Key; ComponentLink5Description: https://datasheet.ciiva.com/910/1n4148ws-910380.pdf?src-supplier=Digi-Key; ComponentLink6URL: https://datasheet.ciiva.com/910/1n4148ws-910381.pdf?src-supplier=Digi-Key; ComponentLink6Description: https://datasheet.ciiva.com/910/1n4148ws-910381.pdf?src-supplier=Digi-Key; ComponentLink7URL: https://datasheet.ciiva.com/910/1n4148ws-910382.pdf?src-supplier=Digi-Key; ComponentLink7Description: https://datasheet.ciiva.com/910/1n4148ws-910382.pdf?src-supplier=Digi-Key; Price: 0.0521
DC = J_JST-XH-02: 2 Pins male XH header; Price: 0.1
FSW1 FSW2 LED2 = JST-XH-02: 2 Pins male XH header; Price: 0.1
IC101 IC202 = LM13700M/NOPB: IC OPAMP TRANSCOND 2MHZ 16SOIC; Manufacturer: TI National Semiconductor; Min Dual Supply Voltage: 5V; Max Dual Supply Voltage: 18V; Max Supply Voltage: 36V; Output Current: 20mA; Input Offset Voltage (Vos): 4mV; Input Bias Current: 8uA; Number of Circuits: 2; Common Mode Rejection Ratio: 80dB; Min Supply Voltage: 10V; Slew Rate: 50V/µs; Nominal Supply Current: 2.6mA; Output Current per Channel: 650uA; Dual Supply Voltage: 9V; Input Resistance: 26kR; Min Input Voltage: -5V; Supplier 1: Farnell; Supplier Part Number 1: 3118203; Manufacturer Part Number: LM13700M/NOPB; RoHS: Yes; Category: Amplifiers - Op Amps, Buffer, Instrumentation; Stock: 890; Pricing: 1=1.01000, 25=0.88700, 50=0.78400, 100=0.68100, 250=0.63800, 500=0.60200, 1000=0.55300, 2500=0.50300 (EUR); Mount: Surface Mount; Case/Package: SOIC; Number of Pins: 16; Contact Plating: Tin; Min Operating Temperature: 0°C; Max Operating Temperature: 70°C; Unity Gain Bandwidth Product: 2MHz; Gain Bandwidth Product: 2MHz; Number of Elements: 2; Package Quantity: 48; Packaging: Rail/Tube; Number of Amplifiers: 2; Number of Channels: 2; Max Input Voltage: 5V; Max Supply Current: 2.6mA; Max Output Current: 650uA; Length: 9.91mm; Height: 1.45mm; Width: 3.91mm; Radiation Hardening: No; Lead Free: Lead Free; REACH SVHC: No SVHC; ComponentLink1URL: https://datasheet.ciiva.com/27055/1992224-27055814.pdf?src-supplier=Jameco; ComponentLink1Description: https://datasheet.ciiva.com/27055/1992224-27055814.pdf?src-supplier=Jameco; ComponentLink2URL: https://datasheet.ciiva.com/15128/getdatasheetpartid-55618-15128167.pdf?src-supplier=Verical; ComponentLink2Description: https://datasheet.ciiva.com/15128/getdatasheetpartid-55618-15128167.pdf?src-supplier=Verical; ComponentLink3URL: https://datasheet.ciiva.com/1488/1839252-1488541.pdf?src-supplier=Element14; ComponentLink3Description: https://datasheet.ciiva.com/1488/1839252-1488541.pdf?src-supplier=Element14; ComponentLink4URL: https://datasheet.ciiva.com/1582/87555-1582990.pdf?src-supplier=Newark; ComponentLink4Description: https://datasheet.ciiva.com/1582/87555-1582990.pdf?src-supplier=Newark; ComponentLink5URL: https://datasheet.ciiva.com/14094/iplm13700-data-e-14094251.pdf?src-supplier=Distrelec; ComponentLink5Description: https://datasheet.ciiva.com/14094/iplm13700-data-e-14094251.pdf?src-supplier=Distrelec; ComponentLink6URL: https://datasheet.ciiva.com/1804/lm13700-1804254.pdf?src-supplier=Digi-Key; ComponentLink6Description: https://datasheet.ciiva.com/1804/lm13700-1804254.pdf?src-supplier=Digi-Key
IC102 = TL072CDT: IC OPAMP JFET 4MHZ 8SO; Manufacturer: STMicroelectronics; Common Mode Rejection Ratio: 70dB; Min Dual Supply Voltage: 3V; Voltage Gain: 106.02dB; Slew Rate: 16V/µs; Min Supply Voltage: 6V; Max Supply Voltage: 36V; Max Dual Supply Voltage: 18V; Number of Channels: 2; Dual Supply Voltage: 9V; Output Current: 40mA; Nominal Supply Current: 2.5mA; Input Bias Current: 200pA; Input Offset Voltage (Vos): 10mV; Operating Supply Current: 1.4mA; Supplier 1: Farnell; Supplier Part Number 1: 1467663; Manufacturer Part Number: TL072CDT; Stock: 1760; Pricing: 5=0.351, 50=0.313, 100=0.188, 500=0.167, 1000=0.145 (EUR); RoHS: Yes; Mount: Surface Mount; Case/Package: SOIC; Number of Pins: 8; Weight: 0.01lb; Contact Plating: Tin; Min Operating Temperature: 0°C; Max Operating Temperature: 70°C; Gain Bandwidth Product: 4MHz; Unity Gain Bandwidth Product: 4MHz; Packaging: Tape and Reel; Package Quantity: 1; Bandwidth: 4MHz; Operating Supply Voltage: 18V; Number of Circuits: 2; Output Current per Channel: 40mA; Number of Elements: 2; Number of Amplifiers: 2; Length: 4.9mm; Height: 1.25mm; Width: 3.9mm; Radiation Hardening: No; REACH SVHC: No SVHC; Lead Free: Lead Free; ComponentLink1URL: https://datasheet.ciiva.com/15129/getdatasheetpartid-40113-15129688.pdf?src-supplier=Verical; ComponentLink1Description: https://datasheet.ciiva.com/15129/getdatasheetpartid-40113-15129688.pdf?src-supplier=Verical; ComponentLink2URL: https://datasheet.ciiva.com/29306/155616-da-01-en-op-verst-tl072cdt-stm-29306849.pdf?src-supplier=Conrad; ComponentLink2Description: https://datasheet.ciiva.com/29306/155616-da-01-en-op-verst-tl072cdt-stm-29306849.pdf?src-supplier=Conrad; ComponentLink3URL: https://datasheet.ciiva.com/26847/tl072cdt-26847276.pdf?src-supplier=IIIC; ComponentLink3Description: https://datasheet.ciiva.com/26847/tl072cdt-26847276.pdf?src-supplier=IIIC; ComponentLink4URL: https://datasheet.ciiva.com/1795/cd00000490-1795664.pdf?src-supplier=Digi-Key; ComponentLink4Description: https://datasheet.ciiva.com/1795/cd00000490-1795664.pdf?src-supplier=Digi-Key; ComponentLink5URL: https://datasheet.ciiva.com/1795/cd00000490-1795665.pdf?src-supplier=Digi-Key; ComponentLink5Description: https://datasheet.ciiva.com/1795/cd00000490-1795665.pdf?src-supplier=Digi-Key; ComponentLink6URL: https://datasheet.ciiva.com/1795/cd00000490-1795666.pdf?src-supplier=Digi-Key; ComponentLink6Description: https://datasheet.ciiva.com/1795/cd00000490-1795666.pdf?src-supplier=Digi-Key; ComponentLink7URL: https://datasheet.ciiva.com/8008/1674510-8008556.pdf?src-supplier=Element14; ComponentLink7Description: https://datasheet.ciiva.com/8008/1674510-8008556.pdf?src-supplier=Element14; ComponentLink8URL: https://datasheet.ciiva.com/14151/tl072-tl072a-tl072b-st-tds-eng-14151196.pdf?src-supplier=Distrelec; ComponentLink8Description: https://datasheet.ciiva.com/14151/tl072-tl072a-tl072b-st-tds-eng-14151196.pdf?src-supplier=Distrelec; ComponentLink9URL: https://datasheet.ciiva.com/8008/1674510-8008557.pdf?src-supplier=Element14; ComponentLink9Description: https://datasheet.ciiva.com/8008/1674510-8008557.pdf?src-supplier=Element14; Price: 0.351
IC201 = TL074IDT: IC OPAMP JFET 3MHZ 14SO; Manufacturer: STMicroelectronics; Voltage Gain: 106.02dB; Min Dual Supply Voltage: 3V; Common Mode Rejection Ratio: 80dB; Dual Supply Voltage: 9V; Slew Rate: 13V/µs; Number of Channels: 4; Max Dual Supply Voltage: 18V; Nominal Supply Current: 2.5mA; Input Bias Current: 200pA; Input Offset Voltage (Vos): 3mV; Operating Supply Current: 1.4mA; Min Supply Voltage: 6V; Output Current: 40mA; Max Input Voltage: 15V; Min Input Voltage: -12V; Power Dissipation: 680mW; Supplier 1: Farnell; Supplier Part Number 1: 1750154; Manufacturer Part Number: TL074IDT; RoHS: Yes; Category: Amplifiers - Op Amps, Buffer, Instrumentation; Stock: 18824; Pricing: 5=0.48500, 50=0.42800, 100=0.26100, 500=0.23200, 1000=0.20200 (EUR); Mount: Surface Mount; Case/Package: SOIC; Number of Pins: 14; Min Operating Temperature: -40°C; Max Operating Temperature: 105°C; Gain Bandwidth Product: 3MHz; Bandwidth: 3MHz; Packaging: Tape and Reel; Unity Gain Bandwidth Product: 3MHz; Package Quantity: 2500; Number of Circuits: 4; Number of Amplifiers: 4; Number of Elements: 4; Max Supply Voltage: 18V; Output Current per Channel: 40mA; Length: 8.75mm; Height: 1.65mm; Width: 4mm; Radiation Hardening: No; REACH SVHC: No SVHC; Lead Free: Lead Free; ComponentLink1URL: https://datasheet.ciiva.com/26846/tl074idt-26846545.pdf?src-supplier=IIIC; ComponentLink1Description: https://datasheet.ciiva.com/26846/tl074idt-26846545.pdf?src-supplier=IIIC; ComponentLink2URL: https://datasheet.ciiva.com/1795/cd00000489-1795785.pdf?src-supplier=Digi-Key; ComponentLink2Description: https://datasheet.ciiva.com/1795/cd00000489-1795785.pdf?src-supplier=Digi-Key; ComponentLink3URL: https://datasheet.ciiva.com/1795/cd00000489-1795786.pdf?src-supplier=Digi-Key; ComponentLink3Description: https://datasheet.ciiva.com/1795/cd00000489-1795786.pdf?src-supplier=Digi-Key; ComponentLink4URL: https://datasheet.ciiva.com/1795/cd00000489-1795787.pdf?src-supplier=Digi-Key; ComponentLink4Description: https://datasheet.ciiva.com/1795/cd00000489-1795787.pdf?src-supplier=Digi-Key
INPUT OUTPUT = J_STEREO: 6.35mm stereo insulated socket jack PCB mounted; Price: 0.5
K1 K2 = G6K-2F5DC: OMRON - G6K-2F 5DC - RELAY, SIGNAL, DPDT, 30VDC, 1A; Manufacturer: Cliff; Coil Resistance: 237R; Coil Voltage (DC): 5V; Coil Current: 21.1mA; Coil Power: 100mW; Coil Type: Non-Latching; Release Time: 1.3ms; Contact Resistance: 100mR; Insulation Resistance: 1GR; Number of Poles: 2; Supplier 1: Farnell; Supplier Part Number 1: 4446185; Manufacturer Part Number: G6K-2F5DC; Stock: 0; RoHS: Yes; Mount: PCB; Case/Package: SMD/SMT; Contact Material: Gold; Min Operating Temperature: -40°C; Max Operating Temperature: 70°C; Contact Current Rating: 1A; Termination: SMD/SMT; Current Rating: 21.1mA; Power Rating: 100mW; Length: 10mm; Height: 5.2mm; Depth: 7.8mm; Width: 10mm; REACH SVHC: Unknown; ComponentLink1URL: https://datasheet.ciiva.com/1524/1702879-1524968.pdf?src-supplier=Element14; ComponentLink1Description: https://datasheet.ciiva.com/1524/1702879-1524968.pdf?src-supplier=Element14; Price: 2.68
LED1 = J_JST-XH-03: 3 Pins male XH header
LEVEL VOLUME = POT_50kA_ALPHA_9mm: 50k Log potentiometer round shaft; Price: 1.3; Dimensions: 9mm; Package: PCB Mounted
MODE = SW_DIP_3WAY: DIP Switch 3 way; Price: 0.1
OK1 = TLP175A: Toshiba TLP175A AC Input MOSFET Output Optocoupler, Surface Mount, 4-Pin SOIC; Isolation Voltage: 3.75kV; Max Input Current: 80mA; Number of Channels: 1; Rise Time: 1ms; Supplier 1: Farnell; Supplier Part Number 1: 2524257; Manufacturer: Toshiba; Manufacturer Part Number: TLP175A; Stock: 0; Pricing: 5=0.877, 25=0.717, 100=0.597, 250=0.546, 500=0.49, 1000=0.441 (EUR); RoHS: No; Mount: Surface Mount; Case/Package: SOIC; Number of Pins: 4; Fall Time: 1ms; REACH SVHC: Unknown; ComponentLink1URL: http://www.farnell.com/datasheets/2017792.pdf?src-supplier=Farnell; ComponentLink1Description: http://www.farnell.com/datasheets/2017792.pdf?src-supplier=Farnell; ComponentLink2URL: http://uk.rs-online.com/webdocs/129d/0900766b8129d5be.pdf?src-supplier=RSComponents; ComponentLink2Description: http://uk.rs-online.com/webdocs/129d/0900766b8129d5be.pdf?src-supplier=RSComponents; ComponentLink3URL: http://www.farnell.com/datasheets/2017792.pdf?src-supplier=Element14; ComponentLink3Description: http://www.farnell.com/datasheets/2017792.pdf?src-supplier=Element14; ComponentLink4URL: http://www.farnell.com/datasheets/2017792.pdf?src-supplier=Newark; ComponentLink4Description: http://www.farnell.com/datasheets/2017792.pdf?src-supplier=Newark; Price: 0.829
PROG = J_HEADER_6PINS_FEM: 5 Pins female header; Pin spacing: 2.54mm; Price: 0.01
Q1 Q2 = MMBT2222AWT1G: TRANS NPN 40V 0.6A SOT323; Manufacturer: ON Semiconductor; Frequency: 300MHz; hFE Min: 35; Max Power Dissipation: 150mW; Collector Base Voltage (VCBO): 75V; Emitter Base Voltage (VEBO): 6V; Collector Emitter Saturation Voltage: 1V; Max Collector Current: 600mA; Number of Elements: 1; Element Configuration: Single; Max Frequency: 100MHz; Current Rating: 28A; Supplier 1: Farnell; Supplier Part Number 1: 2317589; Manufacturer Part Number: MMBT2222AWT1G; Stock: 16918; Pricing: 5=0.118, 50=0.114, 100=0.0413, 500=0.025, 1500=0.024 (EUR); RoHS: Yes; Case/Package: SC; Number of Pins: 3; Contact Plating: Tin; Min Operating Temperature: -55°C; Max Operating Temperature: 150°C; Package Quantity: 1; Collector Emitter Voltage (VCEO): 40V; Packaging: Tape and Reel; Polarity: NPN; Collector Emitter Breakdown Voltage: 40V; Transition Frequency: 300MHz; Power Dissipation: 150mW; Gain Bandwidth Product: 300MHz; Max Breakdown Voltage: 40V; Voltage Rating (DC): 40V; Length: 2.2mm; Height: 1mm; Width: 1.35mm; Radiation Hardening: No; Lead Free: Lead Free; REACH SVHC: No SVHC; ComponentLink1URL: https://datasheet.ciiva.com/15139/getdatasheetpartid-76779-15139056.pdf?src-supplier=Verical; ComponentLink1Description: https://datasheet.ciiva.com/15139/getdatasheetpartid-76779-15139056.pdf?src-supplier=Verical; ComponentLink2URL: https://datasheet.ciiva.com/4722/mmbt2222awt1-d-110211-4722257.pdf?src-supplier=Mouser; ComponentLink2Description: https://datasheet.ciiva.com/4722/mmbt2222awt1-d-110211-4722257.pdf?src-supplier=Mouser; ComponentLink3URL: https://datasheet.ciiva.com/16478/mmbt2222awt1-d-16478517.pdf?src-supplier=Avnet+Asia; ComponentLink3Description: https://datasheet.ciiva.com/16478/mmbt2222awt1-d-16478517.pdf?src-supplier=Avnet+Asia; ComponentLink4URL: https://datasheet.ciiva.com/11201/mmbt2222awt1-d-11201756.pdf?src-supplier=Avnet; ComponentLink4Description: https://datasheet.ciiva.com/11201/mmbt2222awt1-d-11201756.pdf?src-supplier=Avnet; ComponentLink5URL: https://datasheet.ciiva.com/16221/mmbt2222awt1-d-16221845.pdf?src-supplier=Future+Electronics; ComponentLink5Description: https://datasheet.ciiva.com/16221/mmbt2222awt1-d-16221845.pdf?src-supplier=Future+Electronics; ComponentLink6URL: https://datasheet.ciiva.com/7972/mmbt2222awt1-d-7972374.pdf?src-supplier=Element14; ComponentLink6Description: https://datasheet.ciiva.com/7972/mmbt2222awt1-d-7972374.pdf?src-supplier=Element14; ComponentLink7URL: https://datasheet.ciiva.com/22664/1708260-22664154.pdf?src-supplier=Element14; ComponentLink7Description: https://datasheet.ciiva.com/22664/1708260-22664154.pdf?src-supplier=Element14; ComponentLink8URL: https://datasheet.ciiva.com/976/mmbt2222awt1-d-976443.pdf?src-supplier=Digi-Key; ComponentLink8Description: https://datasheet.ciiva.com/976/mmbt2222awt1-d-976443.pdf?src-supplier=Digi-Key; Price: 0.0413